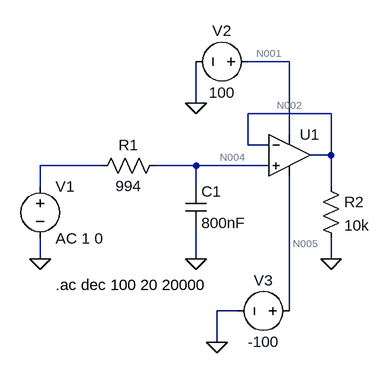
[diagram p0: schematic Voltage follower.asc]
Voltage follower.asc, the LTspice schematic file:
Version 4
SHEET 1 880 680
WIRE 384 -64 320 -64
WIRE 240 0 240 -64
WIRE 448 16 320 16
WIRE 384 48 384 -64
WIRE 320 64 320 16
WIRE 352 64 320 64
WIRE 448 80 448 16
WIRE 448 80 416 80
WIRE 96 96 0 96
WIRE 240 96 176 96
WIRE 352 96 240 96
WIRE 0 128 0 96
WIRE 240 128 240 96
WIRE 448 128 448 80
WIRE 0 240 0 208
WIRE 240 240 240 192
WIRE 448 240 448 208
WIRE 304 320 272 320
WIRE 384 320 384 112
WIRE 272 368 272 320
FLAG 0 240 0
FLAG 240 240 0
FLAG 448 240 0
FLAG 240 0 0
FLAG 272 368 0
SYMBOL voltage 0 112 R0
SYMATTR InstName V1
SYMATTR Value AC 1 0
SYMBOL res 192 80 R90
WINDOW 0 0 56 VBottom 2
WINDOW 3 32 56 VTop 2
SYMATTR InstName R1
SYMATTR Value 994
SYMBOL cap 224 128 R0
SYMATTR InstName C1
SYMATTR Value 800nF
SYMBOL res 432 112 R0
SYMATTR InstName R2
SYMATTR Value 10k
SYMBOL OpAmps\\UniversalOpamp2 384 80 R0
SYMATTR InstName U1
SYMBOL voltage 336 -64 R90
WINDOW 0 -32 56 VBottom 2
WINDOW 3 32 56 VTop 2
SYMATTR InstName V2
SYMATTR Value 100
SYMBOL voltage 400 320 R90
WINDOW 0 -32 56 VBottom 2
WINDOW 3 32 56 VTop 2
SYMATTR InstName V3
SYMATTR Value -100
TEXT 24 280 Left 2 !.ac dec 100 20 20000

The netlist it stands for:
* Voltage follower.asc
V1 N003 0 AC 1 0
R1 N004 N003 994
C1 N004 0 800nF
R2 N002 0 10k
XU1 N004 N002 N001 N005 N002 level.2 Avol=1Meg GBW=10Meg Slew=10Meg ilimit=25m rail=0 Vos=0 phimargin=45 en=0 enk=0 in=0 ink=0 Rin=500Meg  ; pins IN+ IN- V+ V- OUT
V2 N001 0 100
V3 N005 0 -100
.ac dec 100 20 20000
.lib UniversalOpamps2.sub
.backanno
.end

* Results of the author's LTspice run, read from the files saved beside the schematic
* Operating Point, zero values left out:
*   V(n001) = 100 V
*   V(n005) = -100 V
*   I(V3) = 9.499 mA
*   I(V2) = -9.499 mA
*   Ix(u1:3) = 9.499 mA
*   Ix(u1:4) = -9.499 mA
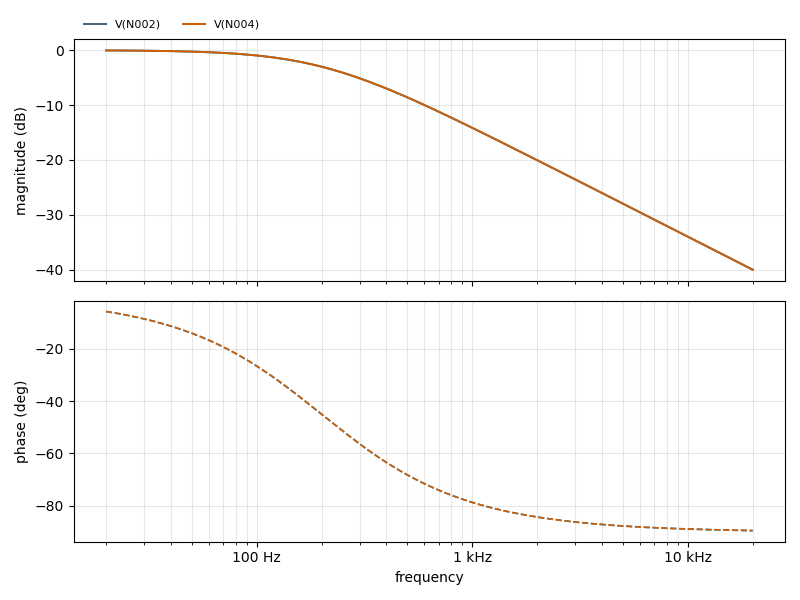
[diagram p1: AC Analysis of Voltage follower.asc, plotted from the saved traces]
* AC Analysis, 1 run:
*   V(N002): -0.04 dB at 20 Hz, -39.99 dB at 20 kHz, peak -0.04 dB at 20 Hz, 3 dB below the peak at 202.1 Hz
*   V(N004): -0.04 dB at 20 Hz, -39.99 dB at 20 kHz, peak -0.04 dB at 20 Hz, 3 dB below the peak at 202.1 Hz